# EAGLE design LCmeter0 (EAGLE 7.2.0)
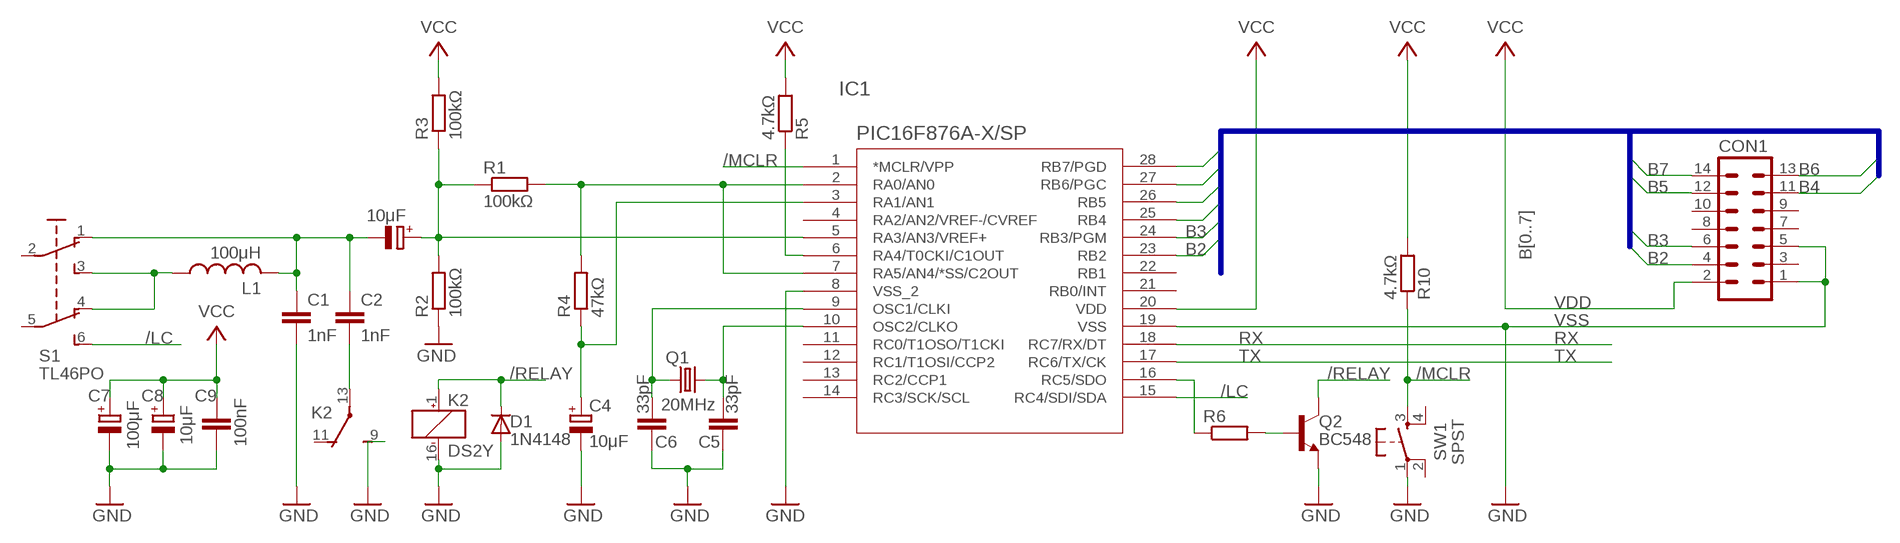
[diagram p0: schematic, sheet 1]

## Parts
C1  1nF  C-EU050-025X075  [C050-025X075]
C2  1nF  C-EU050-025X075  [C050-025X075]
C3  10μF  CPOL-EUE2.5-6  [E2,5-6]
C4  10μF  CPOL-EUE5-6  [E5-6]
C5  33pF  C-EU050-025X075  [C050-025X075]
C6  33pF  C-EU050-025X075  [C050-025X075]
C7  100μF  CPOL-EUE2.5-6  [E2,5-6]
C8  10μF  CPOL-EUE2.5-5  [E2,5-5]
C9  100nF  C-EU025-024X044  [C025-024X044]
CON1  MA07-2  [MA07-2]
D1  1N4148  1N4148DO35-7  [DO35-7]
IC1  PIC16F876A-X/SP  [DIL28-3]
K2  DS2Y  DS2Y-S-DC5V  [DS2Y]
L1  100μH  L-US0207/10  [0207/10]
Q1  20MHz  CRYSTALHC49U70  [HC49U70]
Q2  BC548  [TO92-EBC]
R1  100kΩ  R-EU_0207/10  [0207/10]
R2  100kΩ  R-EU_0207/10  [0207/10]
R3  100kΩ  R-EU_0204/2V  [0204V]
R4  47kΩ  R-EU_0207/10  [0207/10]
R5  4.7kΩ  R-EU_0204/2V  [0204V]
R6  R-EU_0207/10  [0207/10]
R10  4.7kΩ  R-EU_0204/2V  [0204V]
S1  TL46PO  [TL4XPO]
SW1  SPST  PB-SPST  [PB-5]

## Nets
/LC: IC1.15(RC4/SDI/SDA) S1.6(S1)
/MCLR: IC1.1(*MCLR/VPP) R10.1 SW1.3(S)
/RELAY: D1.C K2.1(1:+) Q2.C
A0: IC1.2(RA0/AN0) IC1.7(RA5/AN4/*SS/C2OUT) R1.2 R4.2
A1: C4.+ IC1.3(RA1/AN1) R4.1
A3: C3.+ IC1.5(RA3/AN3/VREF+) R1.1 R2.2 R3.1
A4: IC1.6(RA4/T0CKI/C1OUT) R5.1
B2: CON1.4 IC1.23(RB2)
B3: CON1.6 IC1.24(RB3/PGM)
B4: CON1.11 IC1.25(RB4)
B5: CON1.12 IC1.26(RB5)
B6: CON1.13 IC1.27(RB6/PGC)
B7: CON1.14 IC1.28(RB7/PGD)
N$1: C2.2 K2.13(3:P)
N$2: C1.1 C2.1 C3.- L1.2 S1.1(O)
N$3: CON1.2 ; supply symbol labelled VCC
N$5: Q2.B R6.2
N$7: L1.1 S1.3(S) S1.4(O1)
OSC1: C6.2 IC1.9(OSC1/CLKI) Q1.1
OSC2: C5.2 IC1.10(OSC2/CLKO) Q1.2
RC5: IC1.16(RC5/SDO) R6.1
RX: IC1.18(RC7/RX/DT)
TX: IC1.17(RC6/TX/CK)
VDD: C7.+ C8.+ C9.1 IC1.20(VDD) R3.2 R5.2 R10.2 ; supply symbol labelled VCC
VSS: C1.2 C4.- C5.1 C6.1 C7.- C8.- C9.2 CON1.1 CON1.5 D1.A IC1.8(VSS_2) IC1.19(VSS) K2.9(3:S) K2.16(1:-) Q2.E R2.1 SW1.1(P) ; supply symbol labelled GND
Unconnected: CON1.3 CON1.7 CON1.8 CON1.9 CON1.10 IC1.4(RA2/AN2/VREF-/CVREF) IC1.11(RC0/T1OSO/T1CKI) IC1.12(RC1/T1OSI/CCP2) IC1.13(RC2/CCP1) IC1.14(RC3/SCK/SCL) IC1.21(RB0/INT) IC1.22(RB1) K2.4(2:P) K2.6(2:O) K2.8(2:S) K2.11(3:O) S1.2(P) S1.5(P1) SW1.2(P1) SW1.4(S1)

## Buses
B[0..7]

## Library data of the parts
C1 C2 C5 C6 C9 = rcl:C-EU: CAPACITOR, European symbol
C3 C4 C7 C8 = rcl:CPOL-EU: POLARIZED CAPACITOR, European symbol
CON1 = con-lstb:MA07-2: PIN HEADER; OC_FARNELL: unknown; OC_NEWARK: unknown
D1 = diode:1N4148: DIODE high speed (Philips)
IC1 = mcu:PIC16F876A-X/SP
K2 = relay:DS2Y-S-DC*: MINIATURE RELAY NAiS Source: http://www.mew-europe.com/.. en_ds_61005_0023.pdf; MPN: DS2Y-S-DC5V; OC_FARNELL: unknown; OC_NEWARK: 13P3268
L1 = rcl:L-US: INDUCTOR, American symbol
Q1 = crystal:CRYSTAL: CRYSTAL; OC_FARNELL: unknown; OC_NEWARK: unknown
Q2 = transistor-npn:BC548*: NPN Transistor
R1-R5 R10 = resistor:R-EU_: RESISTOR, European symbol
R6 = rcl:R-EU_: RESISTOR, European symbol
S1 = switch:TL46PO: TINY SWITCH ON - ON Source: http://www2.produktinfo.conrad.com/datenblaetter/700000-724999/705152-da-01-de-Subminiaturschalter_TL_36YO.pdf
SW1 = mcu:PB-SPST

## Board
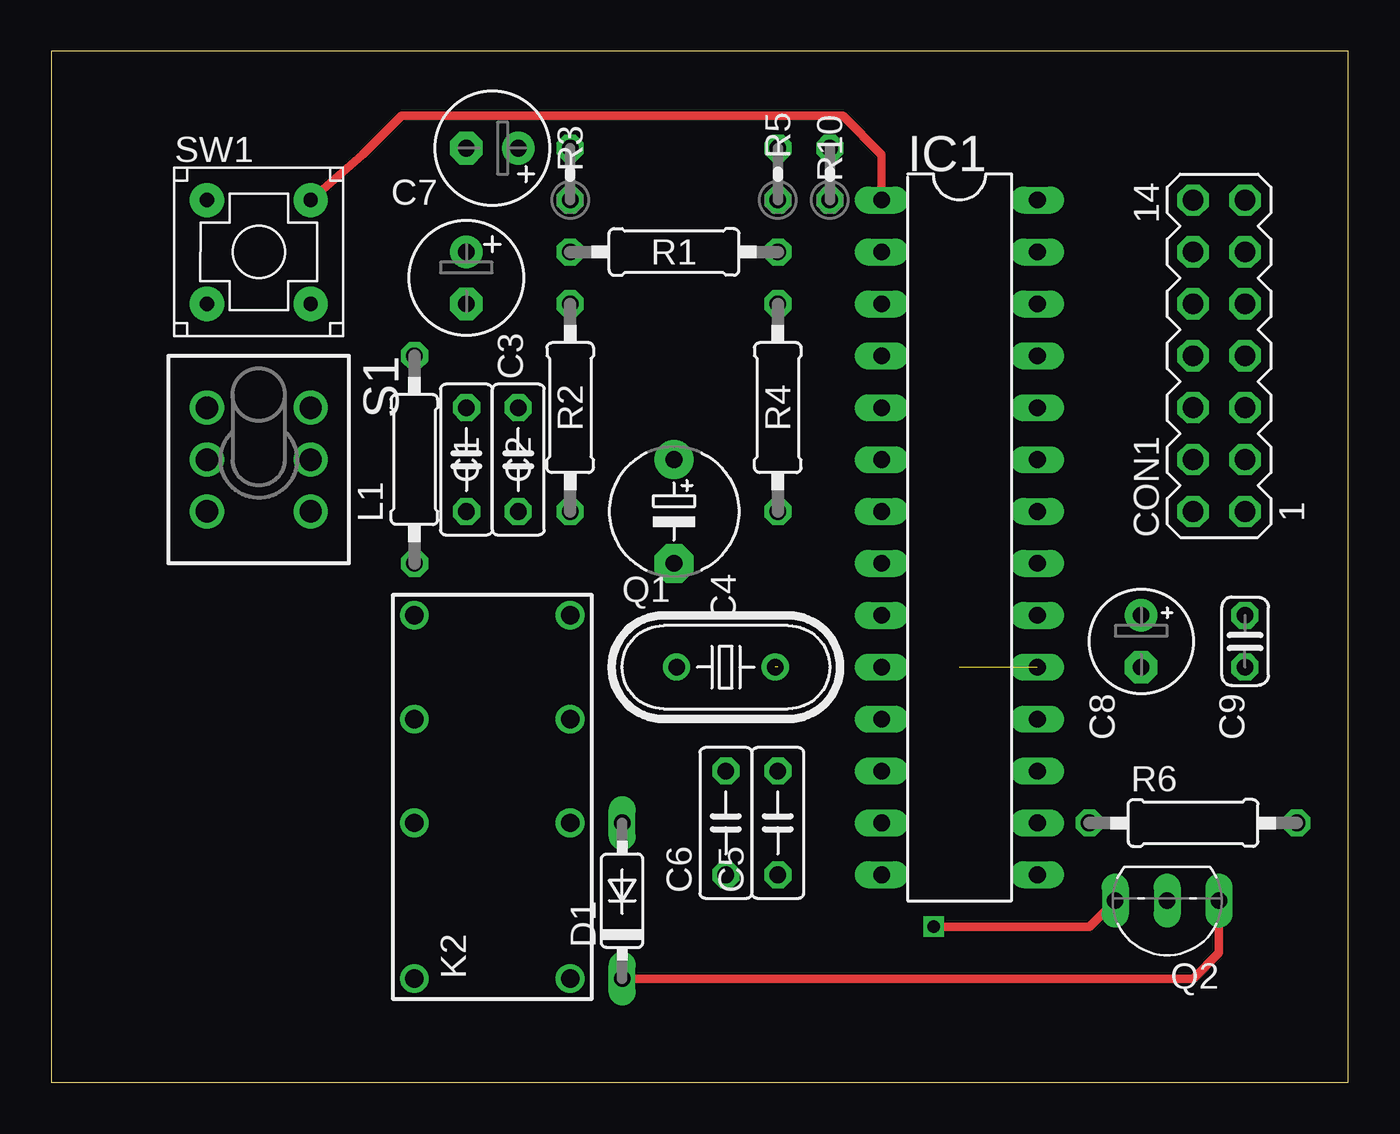
[diagram p1: board, top side]
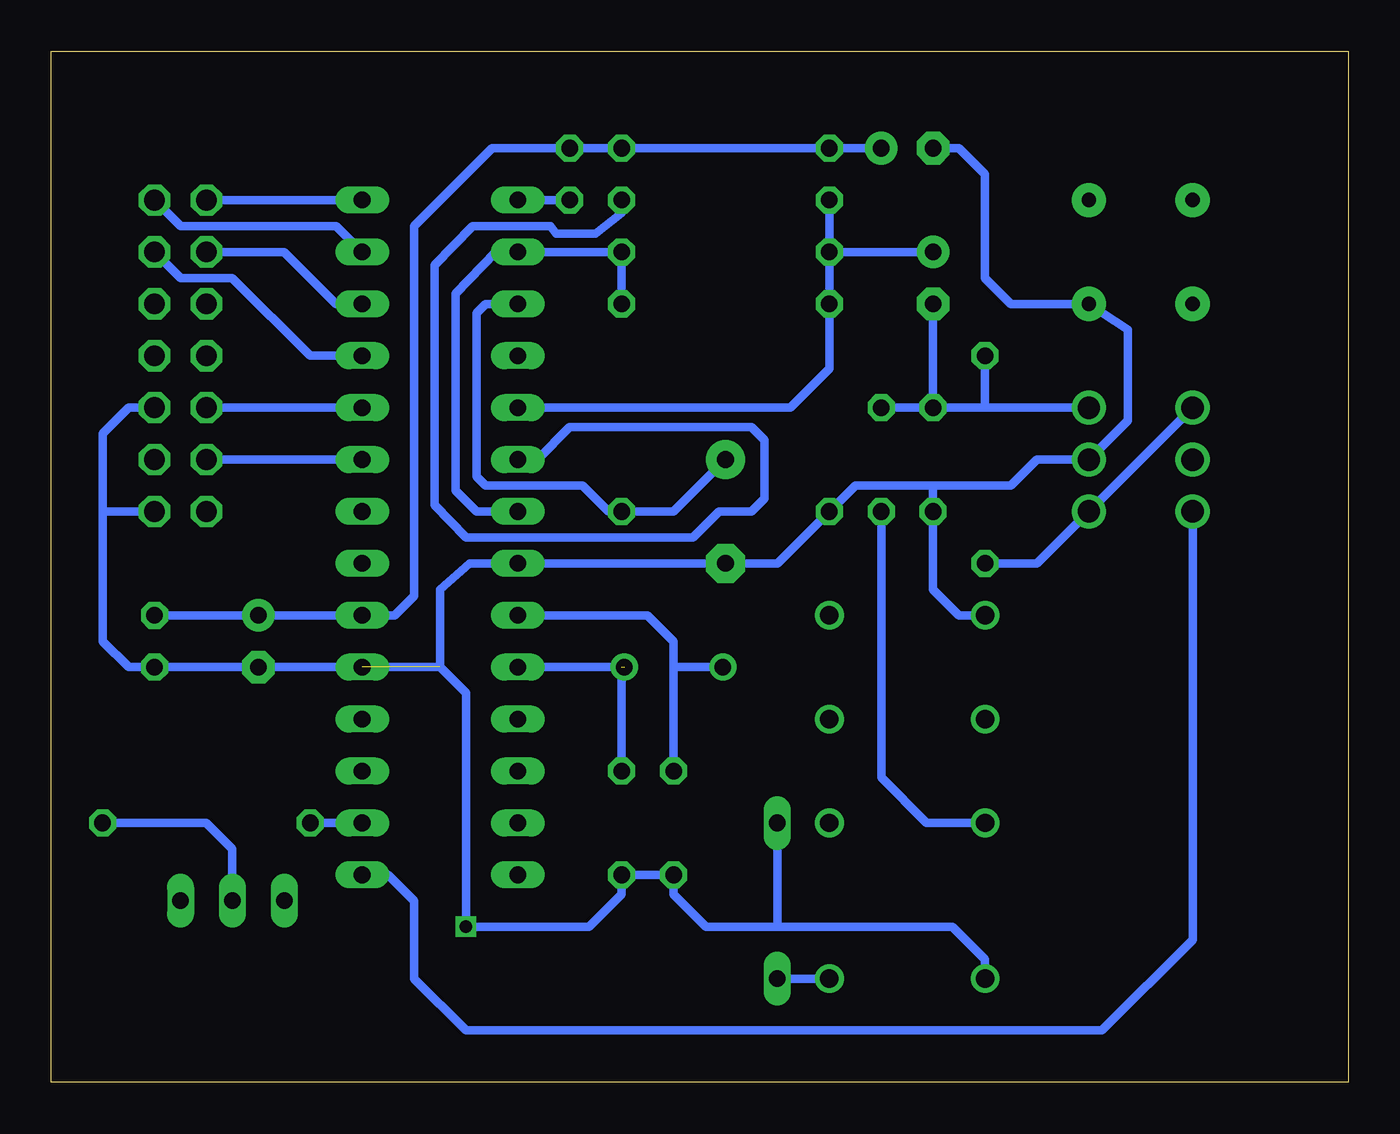
[diagram p2: board, bottom side, seen from below]

Size 63.48 x 50.47 mm. Coordinates in mm from the lower left corner, seen from the top.
Outline: 0,0 63.48,0 63.48,50.47 0,50.47 0,0
Copper layers (1*16): Top 0.035mm / dielectric 1.5mm / Bottom 0.035mm
Design rules "default": minimum track width 10mil, minimum drill 24mil, track to track 8mil, track to pad 8mil, pad to pad 8mil, via to via 8mil, smd to smd 8mil, copper to edge 40mil, drill to drill 8mil, minimum pad ring 10mil, minimum via ring 8mil, stop-mask expansion 4mil, vias tented up to drill 0mil, thermal gap 10mil

### Footprints (pad centres in the part's own frame; a part is rotated, then mirrored left to right if it is on the bottom)
C050-025X075 = drill 0.813 octagon: 1 -2.54,0; 2 2.54,0
E2,5-6 = drill 0.813 pad 1.6: + -1.27,0 | drill 0.813 pad 1.6 octagon: - 1.27,0
E5-6 = drill 0.813 pad 1.905: + -2.54,0 | drill 0.813 pad 1.905 octagon: - 2.54,0
E2,5-5 = drill 0.813 pad 1.6: + -1.27,0 | drill 0.813 pad 1.6 octagon: - 1.27,0
C025-024X044 = drill 0.813 octagon: 1 -1.27,0; 2 1.27,0
MA07-2 = drill 1.016 octagon: 1 -7.62,-1.27; 2 -7.62,1.27; 3 -5.08,-1.27; 4 -5.08,1.27; 5 -2.54,-1.27; 6 -2.54,1.27; 7 0,-1.27; 8 0,1.27; 9 2.54,-1.27; 10 2.54,1.27; 11 5.08,-1.27; 12 5.08,1.27; 13 7.62,-1.27; 14 7.62,1.27
DO35-7 = drill 0.813 long: A 3.81,0; C -3.81,0
DIL28-3 = drill 0.813 long: 1 -16.51,-3.81; 2 -13.97,-3.81; 3 -11.43,-3.81; 4 -8.89,-3.81; 5 -6.35,-3.81; 6 -3.81,-3.81; 7 -1.27,-3.81; 8 1.27,-3.81; 9 3.81,-3.81; 10 6.35,-3.81; 11 8.89,-3.81; 12 11.43,-3.81; 13 13.97,-3.81; 14 16.51,-3.81; 15 16.51,3.81; 16 13.97,3.81; 17 11.43,3.81; 18 8.89,3.81; 19 6.35,3.81; 20 3.81,3.81; 21 1.27,3.81; 22 -1.27,3.81; 23 -3.81,3.81; 24 -6.35,3.81; 25 -8.89,3.81; 26 -11.43,3.81; 27 -13.97,3.81; 28 -16.51,3.81
DS2Y = drill 0.9: 1 -8.89,-3.81; 4 -1.27,-3.81; 6 3.81,-3.81; 8 8.89,-3.81; 9 8.89,3.81; 11 3.81,3.81; 13 -1.27,3.81; 16 -8.89,3.81
0207/10 = drill 0.813 octagon: 1 -5.08,0; 2 5.08,0
HC49U70 = drill 0.813: 1 -2.413,0; 2 2.413,0
TO92-EBC = drill 0.813 long: B 0,-1.27; C -2.54,-1.27; E 2.54,-1.27
0204V = drill 0.813 octagon: 1 -1.27,0; 2 1.27,0
TL4XPO = drill 1.1 pad 1.676: 1 -2.54,2.54; 2 0,2.54; 3 2.54,2.54; 4 -2.54,-2.54; 5 0,-2.54; 6 2.54,-2.54
PB-5 = drill 0.7 pad 1.676: 1 2.54,-2.54; 2 -2.54,-2.54; 3 2.54,2.54; 4 -2.54,2.54

### Placement (x,y rotation side)
C1  20.32,30.48 270 top
C2  22.86,30.48 270 top
C3  20.32,39.37 270 top
C4  30.48,27.94 270 top
C5  35.56,12.7 90 top
C6  33.02,12.7 90 top
C7  21.59,45.72 180 top
C8  53.34,21.59 270 top
C9  58.42,21.59 270 top
CON1  57.15,35.56 90 top
D1  27.94,8.89 90 top
IC1  44.45,26.67 270 top
K2  21.59,13.97 90 top
L1  17.78,30.48 90 top
Q1  33.02,20.32 0 top
Q2  54.61,7.62 180 top
R1  30.48,40.64 0 top
R2  25.4,33.02 90 top
R3  25.4,44.45 90 top
R4  35.56,33.02 90 top
R5  35.56,44.45 90 top
R6  55.88,12.7 0 top
R10  38.1,44.45 90 top
S1  10.16,30.48 270 top
SW1  10.16,40.64 0 top

### Tracks (layer width: path | path; a pad name or v marks a point on that pad's centre or on a via)
/LC
  Bottom 0.406: IC1.15 46.99,10.16 45.72,8.89 45.72,5.08 43.18,2.54 12.06,2.54 7.62,6.99 S1.6
/MCLR
  Top 0.406: IC1.1 40.64,45.4 38.73,47.31 17.14,47.31 15.24,45.4 SW1.3
  Bottom 0.406: IC1.1 R10.1
/RELAY
  Top 0.406: D1.C 55.88,5.08 57.15,6.35 Q2.C
  Bottom 0.406: D1.C K2.1
A0
  Bottom 0.406: IC1.7 42.67,27.94 43.69,28.97 43.69,38.61 41.72,40.64 IC1.2 R1.2 R4.2
A1
  Bottom 0.406: IC1.3 42.23,38.1 42.67,37.66 42.67,29.65 42.23,29.21 37.47,29.21 36.2,27.94 R4.1 33.02,27.94 C4.+
A3
  Bottom 0.406: R1.1 R3.1 | R1.1 R2.2 25.4,34.92 27.3,33.02 IC1.5 | R1.1 C3.+
A4
  Bottom 0.406: IC1.6 39.69,30.48 38.1,32.07 29.21,32.07 28.57,31.43 28.57,28.57 29.21,27.94 30.8,27.94 32.07,26.67 43.18,26.67 44.7,28.26 44.7,40.01 42.86,41.91 39.05,41.91 38.77,41.53 36.83,41.53 35.56,42.55 R5.1
B2
  Bottom 0.406: IC1.23 CON1.4
B3
  Bottom 0.406: IC1.24 CON1.6
B4
  Bottom 0.406: IC1.25 50.8,35.56 54.61,39.37 57.15,39.37 CON1.11
B5
  Bottom 0.406: IC1.26 49.53,38.1 52.07,40.64 CON1.12
B6
  Bottom 0.406: IC1.27 49.53,41.91 57.15,41.91 CON1.13
B7
  Bottom 0.406: CON1.14 IC1.28
N$1
  Bottom 0.406: C2.2 22.86,14.92 20.64,12.7 K2.13
N$2
  Bottom 0.406: C3.- C1.1 | C2.1 C1.1 | C1.1 17.78,33.02 | 17.78,33.02 L1.2 | S1.1 17.78,33.02
N$5
  Bottom 0.406: R6.2 55.88,12.7 54.61,11.43 Q2.B
N$7
  Bottom 0.406: L1.1 15.24,25.4 S1.3 S1.4
OSC1
  Bottom 0.406: IC1.9 34.29,22.86 33.02,21.59 33.02,20.32 | Q1.1 33.02,20.32 | 33.02,20.32 C6.2
OSC2  (1 unrouted)
  Bottom 0.406: IC1.10 35.56,20.32 C5.2
RC5
  Bottom 0.406: R6.1 IC1.16
VDD
  Bottom 0.406: C9.1 C8.+ IC1.20 46.67,22.86 45.72,23.81 45.72,41.91 41.91,45.72 R10.2 R5.2 R3.2 C7.+
VSS  (via drill 0.6)  (1 unrouted)
  Top 0.406: Q2.E 50.8,7.62 v43.18,7.62
  Bottom 0.406: 44.45,20.32 C8.- C9.2 59.69,20.32 60.96,21.59 60.96,27.94 | 44.45,20.32 43.18,19.05 v43.18,7.62 37.15,7.62 35.56,9.21 C5.1 C6.1 33.02,9.21 31.43,7.62 27.94,7.62 | 27.94,7.62 19.37,7.62 17.78,6.03 K2.16 | 44.45,20.32 44.45,24.13 43.01,25.4 IC1.8 C4.- 27.94,25.4 R2.1 24.13,29.21 20.32,29.21 | K2.9 19.05,22.86 20.32,24.13 C1.2 20.32,29.21 | 27.94,7.62 D1.A | C7.- 19.05,45.72 17.78,44.45 17.78,39.37 16.51,38.1 SW1.1 10.79,36.83 10.79,32.38 12.7,30.48 15.24,30.48 16.51,29.21 20.32,29.21 | CON1.5 59.69,33.02 60.96,31.75 60.96,27.94 | CON1.1 60.96,27.94